# Altium schematic sheet 04-AUDIO_TEST.SchDoc
size C
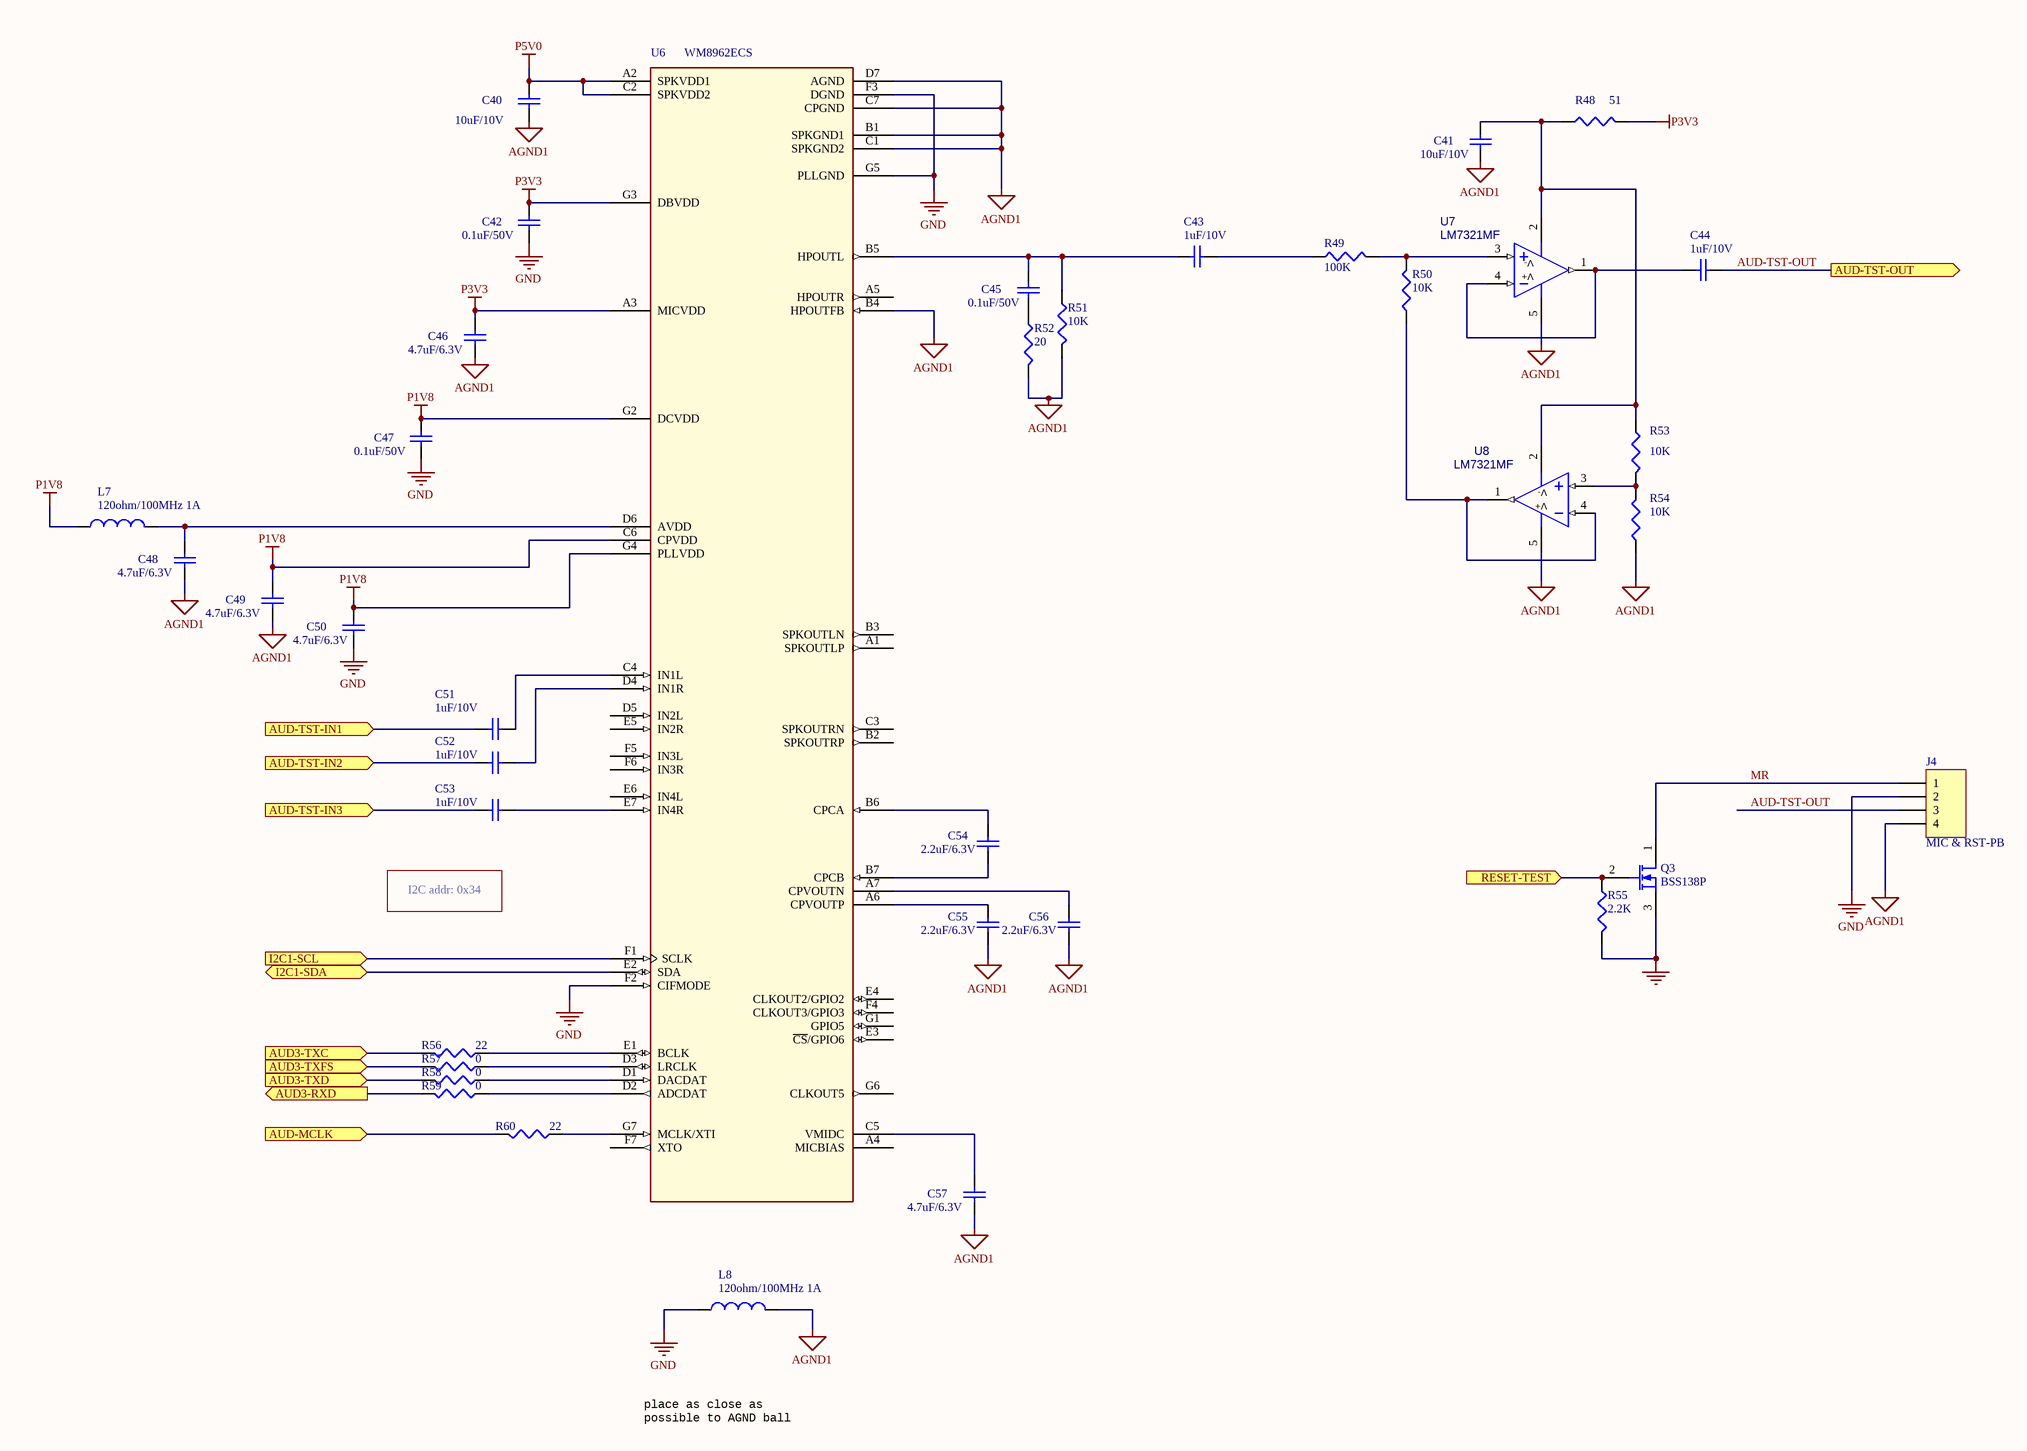
[diagram p0: 04-AUDIO_TEST.SchDoc]

## Parts
C40  10uF/10V  [0805]
C41  10uF/10V  [0805]
C42  0.1uF/50V  [0402]
C43  1uF/10V  [0402]
C44  1uF/10V  [0402]
C45  0.1uF/50V  [0402]
C46  4.7uF/6.3V  [0603]
C47  0.1uF/50V  [0402]
C48  4.7uF/6.3V  [0603]
C49  4.7uF/6.3V  [0603]
C50  4.7uF/6.3V  [0603]
C51  1uF/10V  [0402]
C52  1uF/10V  [0402]
C53  1uF/10V  [0402]
C54  2.2uF/6.3V  [0402]
C55  2.2uF/6.3V  [0402]
C56  2.2uF/6.3V  [0402]
C57  4.7uF/6.3V  [0603]
J4  MIC & RST-PB  [FPC1.0-DR-SMD-4P-F2.0]
L7  120ohm/100MHz 1A  [0603]
L8  120ohm/100MHz 1A  [0603]
Q3  BSS138P  [NPN]
R48  51  [0402]
R49  100K  [0402]
R50  10K  [0402]
R51  10K  [0402]
R52  20  [0402]
R53  10K  [0402]
R54  10K  [0402]
R55  2.2K  [0402]
R56  22  [0402]
R57  0  [0402]
R58  0  [0402]
R59  0  [0402]
R60  22  [0402]
U6  WM8962ECS  [BGA49]
U7  LM7321MF  [SOT23-5]
U8  LM7321MF  [SOT23-5]

## Ports
AUD3-RXD (out), AUD3-TXC (in), AUD3-TXD (in), AUD3-TXFS (in), AUD-MCLK (in), AUD-TST-IN1 (in), AUD-TST-IN2 (in), AUD-TST-IN3 (in), AUD-TST-OUT (out), I2C1-SCL (in), I2C1-SDA (bidir), RESET-TEST (in)

## Nets
AGND1: C40.1 C41.2 C46.1 C48.1 C49.1 C55.1 C56.1 C57.1 J4.4 L8.2 R51.2 R52.2 R54.1 U6.B1(SPKGND1) U6.B4(HPOUTFB) U6.C1(SPKGND2) U6.C7(CPGND) U6.D7(AGND) U7.5(V+) U8.5(V+)
GND: C42.1 C47.1 C50.1 J4.2 L8.1 Q3.3(S) R55.2 U6.F2(CIFMODE) U6.F3(DGND) U6.G5(PLLGND)
P1V8: C47.2 C49.2 C50.2 L7.1 U6.C6(CPVDD) U6.G2(DCVDD) U6.G4(PLLVDD)
P3V3: C42.2 C46.2 R48.2 U6.A3(MICVDD) U6.G3(DBVDD)
P5V0: C40.2 U6.A2(SPKVDD1) U6.C2(SPKVDD2)
AUD3-RXD: R59.2 ; port AUD3-RXD
AUD3-TXC: R56.2 ; port AUD3-TXC
AUD3-TXD: R58.2 ; port AUD3-TXD
AUD3-TXFS: R57.2 ; port AUD3-TXFS
AUD-MCLK: R60.2 ; port AUD-MCLK
AUD-TST-IN1: C51.2 ; port AUD-TST-IN1
AUD-TST-IN2: C52.2 ; port AUD-TST-IN2
AUD-TST-IN3: C53.2 ; port AUD-TST-IN3
AUD-TST-OUT: C44.1 J4.3 ; port AUD-TST-OUT
I2C1-SCL: U6.F1(SCLK) ; port I2C1-SCL
I2C1-SDA: U6.E2(SDA) ; port I2C1-SDA
MR: J4.1 Q3.1(D)
RESET-TEST: Q3.2(G) R55.1 ; port RESET-TEST
NetC41_1: C41.1 R48.1 R53.1 U7.2(V-) U8.2(V-)
NetC43_1: C43.1 R49.1
NetC43_2: C43.2 C45.2 R51.1 U6.B5(HPOUTL)
NetC44_2: C44.2 U7.1(OUT) U7.4(IN-)
NetC45_1: C45.1 R52.1
NetC48_2: C48.2 L7.2 U6.D6(AVDD)
NetC51_1: C51.1 U6.C4(IN1L)
NetC52_1: C52.1 U6.D4(IN1R)
NetC53_1: C53.1 U6.E7(IN4R)
NetC54_1: C54.1 U6.B7(CPCB)
NetC54_2: C54.2 U6.B6(CPCA)
NetC55_2: C55.2 U6.A6(CPVOUTP)
NetC56_2: C56.2 U6.A7(CPVOUTN)
NetC57_2: C57.2 U6.C5(VMIDC)
NetR49_2: R49.2 R50.2 U7.3(IN+)
NetR50_1: R50.1 U8.1(OUT) U8.4(IN-)
NetR53_2: R53.2 R54.2 U8.3(IN+)
NetR56_1: R56.1 U6.E1(BCLK)
NetR57_1: R57.1 U6.D3(LRCLK)
NetR58_1: R58.1 U6.D1(DACDAT)
NetR59_1: R59.1 U6.D2(ADCDAT)
NetR60_1: R60.1 U6.G7(MCLK/XTI)

Not connected (* = marked no-connect by the designer): U6 A1(SPKOUTLP) A4(MICBIAS) A5(HPOUTR) B2(SPKOUTRP) B3(SPKOUTLN) C3(SPKOUTRN) D5(IN2L) E3(~{CS}/GPIO6) E4(CLKOUT2/GPIO2) E5(IN2R) E6(IN4L) F4(CLKOUT3/GPIO3) F5(IN3L) F6(IN3R) F7(XTO) G1(GPIO5) G6(CLKOUT5)

## Notes on the sheet
- I2C addr: 0x34
- place as close as
  possible to AGND ball

## Library data of the parts
C40-C57 = Cap: Capacitor; Published: 8-Jun-2000; LatestRevisionDate: 17-Jul-2002; LatestRevisionNote: Re-released for DXP Platform.; PackageReference: RAD-0.3; Publisher: Altium Limited; PackageDescription: Radial Cap, Thru-Hole; 2 Leads; 0.3 in Pin Spacing
J4 = Header 4: Header, 4-Pin; LatestRevisionDate: 17-Jul-2002; LatestRevisionNote: Re-released for DXP Platform.; Publisher: Altium Limited
L7 L8 = Inductor: Code_IEC: 1005; Value: 300ohm/100MHz BEAD; Published: 8-Jun-2000; LatestRevisionDate: 29-May-2009; LatestRevisionNote: IPC-7351 Footprint Added.; PackageReference: 0402-A; Publisher: Altium Limited; PackageDescription: Chip Inductor; Code_JEITA: 0402
Q3 = MOSFET-N: N-Channel MOSFET; Published: 8-Jun-2000; LatestRevisionDate: 17-Jul-2002; LatestRevisionNote: Re-released for DXP Platform.; PackageVersion: 1995/1996; PackageReference: E3; Publisher: Altium Limited; PackageDescription: TO, Flat Index; 3 In-Line, Axial Leads; Body Dia. 4.6mm; Lead Dia. 0.5 mm (max)
R48-R54 R56-R60 = CR16-1003FM
R55 = Res3: Resistor; Value: 0.1/1W; Published: 8-Jun-2000; LatestRevisionDate: 29-May-2009; LatestRevisionNote: IPC-7351 Footprint Added.; PackageReference: J1-0603; Publisher: Altium Limited; PackageDescription: Chip Resistor
U6 = WM8962_BGA_49P_CUST: IC AUDIO CODEC 24BIT DAC 2 CH ADC 1.8V BGA49; AGILE_PN: 315-79434; MFG_NAME01: WOLFSON MICROELECTRONICS; MFG_PN01: WM8962ECSN/R; CAD_APPROVED: Yes; FPLIST: bga49_0p5_3p62x4,bga49_0p5_3p62x4_smdp; CLASS: IC; ROHS: Yes; HEIGHT: 0.75MM
U7 U8 = LM7321MF: Single 30V High Output Current and Unlimited Capacitive Load Op Amp; Manufacturer: National Semiconductor; Characteristics: LM7321MF Single 30V High Output Current and Unlimited Capacitive Load Op Amp; CompType: OpAmp IC; TaMin_C: -40.0; TaMax_C: 125.0; PowerWise: Y; SymbolVersion: 2008-07-09; PartNumber: LM7321MF; Value: LM7321MF; PackageDescription: 5 Lead SOT-23; PackageReference: MF05A_L; MountType: SMT; RoHS: O; ComponentLink1Description: LM7321 Datasheet; ComponentLink1URL: http://www.ti.com/lit/gpn/LM7321; ComponentLink2Description: LM7321 Web Page; ComponentLink2URL: http://www.ti.com/product/LM7321; ComponentLink3Description: MF05A Package Web Page; ComponentLink3URL: http://www.national.com/packaging/folders/mf05a.html; Version: B1.743; LatestRevisionDate: 2012-11-01; LatestRevisionNote: Mass Update; Publisher: National Semiconductor; Published: 2012-11-01